# Altium project PCB_Project.PrjPcb
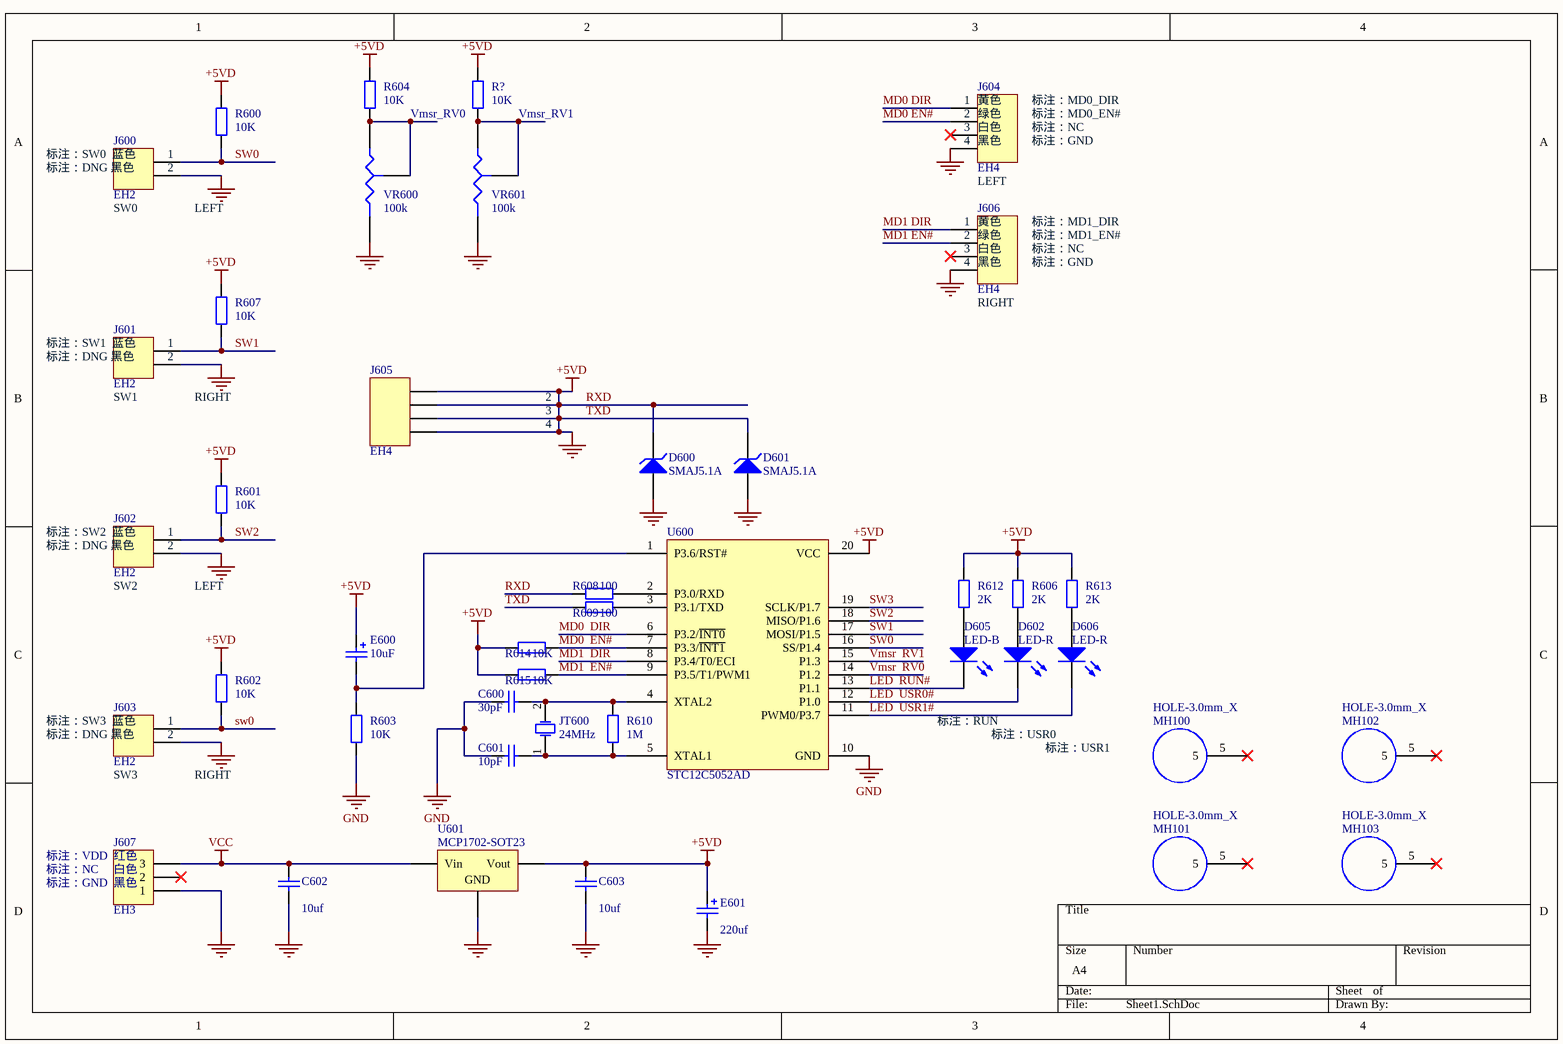
[diagram p0: Sheet1.SchDoc]
1 sheet, 43 parts. Net scope: global (net labels, ports and power ports of the same name join across sheets).
Board file: PCB.PcbDoc

## Sheet Sheet1.SchDoc
size A4

### Parts
C600  value 30pF  [RAD-0.3]  (hidden comment: Cap)
C601  value 10pF  [RAD-0.3]  (hidden comment: Cap)
C602  value 10uf  [RAD-0.3]
C603  value 10uf  [RAD-0.3]
D600  SMAJ5.1A  [DIODE-0.7]
D601  SMAJ5.1A  [DIODE-0.7]
D602  LED-R  [3.2X1.6X1.1]
D605  LED-B  [3.2X1.6X1.1]
D606  LED-R  [3.2X1.6X1.1]
E600  value 10uF  [POLAR0.8]  (hidden comment: Cap Pol2)
E601  value 220uf  [POLAR0.8]
J600  EH2  [HDR1X2H]
J601  EH2  [HDR1X2H]
J602  EH2  [HDR1X2H]
J603  EH2  [HDR1X2H]
J604  EH4  [HDR1X4H]
J605  EH4  [HDR1X4H]
J606  EH4  [HDR1X4H]
J607  EH3  [HDR1X3H]
JT600  24MHz  [R38]
MH100  HOLE-3.0mm_X  [MH]
MH101  HOLE-3.0mm_X  [MH]
MH102  HOLE-3.0mm_X  [MH]
MH103  HOLE-3.0mm_X  [MH]
R600  value 10K  [AXIAL-0.4]  (hidden comment: Res2)
R601  value 10K  [AXIAL-0.4]  (hidden comment: Res2)
R602  value 10K  [AXIAL-0.4]  (hidden comment: Res2)
R603  value 10K  [AXIAL-0.4]  (hidden comment: Res2)
R604  value 10K  [AXIAL-0.4]  (hidden comment: Res2)
R606  value 2K  [AXIAL-0.4]  (hidden comment: Res2)
R607  value 10K  [AXIAL-0.4]  (hidden comment: Res2)
R608  value 100  [AXIAL-0.4]  (hidden comment: Res2)
R609  value 100  [AXIAL-0.4]  (hidden comment: Res2)
R610  value 1M  [AXIAL-0.4]  (hidden comment: Res2)
R612  value 2K  [AXIAL-0.4]  (hidden comment: Res2)
R613  value 2K  [AXIAL-0.4]  (hidden comment: Res2)
R614  value 10K  [AXIAL-0.4]  (hidden comment: Res2)
R615  value 10K  [AXIAL-0.4]  (hidden comment: Res2)
R?  value 10K  [AXIAL-0.4]  (hidden comment: Res2)
U600  STC12C5052AD  [DIP20]
U601  (no value)  [D2PAK_N]
VR600  value 100k  [VR3]
VR601  value 100k  [VR3]

### Nets
+5VD: C600.1 C601.1 C603.2 D600.1(A) D600.2(K) D601.1(A) D601.2(K) E600.1 E601.1 J604.4 J605.1 J605.2 J605.3 J605.4 J606.4 R600.2 R601.2 R602.2 R603.1 R604.2 R606.2 R607.2 R612.2 R613.2 R614.2 R615.2 R?.2 U600.10(GND) U600.20(VCC) U601.3(Vout) VR600.2(B) VR601.2(B)  [also labelled GND]
LEFT: J600.1 J601.1 J602.1 J603.1
NetC602_1: C602.1 C603.1 E601.2 J607.1 U601.2(GND)
VCC: C602.2 J607.3 U601.1(Vin)
LED  RUN#: D605.2(K) U600.13(P1.1)
LED  USR0#: D602.2(K) U600.12(P1.0)
LED  USR1#: D606.2(K) U600.11(PWM0/P3.7)
MD0  DIR: U600.6(P3.2/~{INT0})
MD0  EN#: R614.1 U600.7(P3.3/~{INT1})
MD1  DIR: U600.8(P3.4/T0/ECI)
MD1  EN#: R615.1 U600.9(P3.5/T1/PWM1)
RXD: R608.2
SW0: U600.16(SS/P1.4)
SW1: U600.17(MOSI/P1.5)
SW2: U600.18(MISO/P1.6)
SW3: U600.19(SCLK/P1.7)
TXD: R609.2
Vmsr  RV0: U600.14(P1.2)
Vmsr  RV1: U600.15(P1.3)
NetC600_2: C600.2 JT600.2(OSC2) R610.2 U600.4(XTAL2)
NetC601_2: C601.2 JT600.1(OSC1) R610.1 U600.5(XTAL1)
NetD602_1: D602.1(A) R606.1
NetD605_1: D605.1(A) R612.1
NetD606_1: D606.1(A) R613.1
NetE600_2: E600.2 R603.2 U600.1(P3.6/RST#)
NetJ600_2: J600.2 R600.1
NetJ601_2: J601.2 R607.1
NetJ602_2: J602.2 R601.1
NetJ603_2: J603.2 R602.1
NetR604_1: R604.1 VR600.1(A) VR600.3(TAP)
NetR608_1: R608.1 U600.2(P3.0/RXD)
NetR609_1: R609.1 U600.3(P3.1/TXD)
NetR?_1: R?.1 VR601.1(A) VR601.3(TAP)

Not connected (* = marked no-connect by the designer): J604 1 2 3*; J606 1 2 3*; J607 2*; MH100 5*; MH101 5*; MH102 5*; MH103 5*

### Notes on the sheet
- (near R?) Vmsr_RV0
- Vmsr_RV1
- (near J604) MD0 DIR
- (near J604) MD0 EN#
- (near J604) 1
- (near J604) 2
- (near J604) 黄色
- (near J604) 绿色
- 标注：MD0_DIR
- 标注：MD0_EN#
- (near J600) 标注：SW0  蓝色
- (near J600) 标注：DNG 黑色
- (near J600) 1
- (near J600) 2
- (near R600) SW0
- (near J604) 3
- (near J604) 4
- LEFT
- (near J604) 白色
- (near J604) 黑色
- 标注：NC
- 标注：GND
- (near J600) SW0
- (near J606) MD1 DIR
- (near J606) MD1 EN#
- (near J606) 1
- (near J606) 2
- (near J606) 3
- (near J606) 黄色
- (near J606) 绿色
- (near J606) 白色
- 标注：MD1_DIR
- 标注：MD1_EN#
- (near J606) 4
- (near J606) RIGHT
- (near J606) 黑色
- (near J601) 标注：SW1  蓝色
- (near J601) 标注：DNG 黑色
- (near J601) 1
- (near J601) 2
- (near R607) SW1
- (near J601) SW1
- RIGHT
- 2
- 3
- 4
- RXD
- TXD
- (near J602) 标注：SW2  蓝色
- (near J602) 标注：DNG 黑色
- (near J602) SW2
- (near J602) 1
- (near J602) 2
- (near R601) SW2
- (near J603) 标注：SW3  蓝色
- (near J603) 1
- (near R602) sw0
- 标注：RUN
- (near J603) 标注：DNG 黑色
- (near J603) SW3
- (near J603) 2
- 标注：USR0
- 标注：USR1
- 标注：VDD
- (near J607) 红色
- (near U601) MCP1702-SOT23
- (near U601) Vin
- (near U601) Vout
- (near J607) 白色
- (near J607) 黑色
- (near U601) GND

### Library data of the parts
C600-C603 = Cap: Capacitor; Published: 8-Jun-2000; LatestRevisionDate: 17-Jul-2002; LatestRevisionNote: Re-released for DXP Platform.; PackageReference: RAD-0.3; Publisher: Altium Limited; PackageDescription: Radial Cap, Thru-Hole; 2 Leads; 0.3 in Pin Spacing
D600 D601 = D Zener: Zener Diode; Published: 8-Jun-2000; LatestRevisionDate: 17-Jul-2002; LatestRevisionNote: Re-released for DXP Platform.; PackageReference: DIODE-0.7; Publisher: Altium Limited; PackageDescription: Diode, Thru-Hole; 2 Leads; 0.7 in Pin Spacing
D602 D605 D606 = LED2: Typical RED, GREEN, YELLOW, AMBER GaAs LED; Published: 8-Jun-2000; LatestRevisionDate: 17-Jul-2002; LatestRevisionNote: Re-released for DXP Platform.; PackageVersion: Feb-2002; PackageReference: 3.2X1.6X1.1; Publisher: Altium Limited; PackageDescription: SM LED; 2 Flat Leads
E600 E601 = Cap Pol2: Polarized Capacitor (Axial); Published: 8-Jun-2000; LatestRevisionDate: 17-Jul-2002; LatestRevisionNote: Re-released for DXP Platform.; PackageReference: POLAR0.8; Publisher: Altium Limited; PackageDescription: Polarized Capacitor; 2 Leads
J600-J603 = Header 2H: Header, 2-Pin, Right Angle; LatestRevisionDate: 17-Jul-2002; LatestRevisionNote: Re-released for DXP Platform.; Publisher: Altium Limited
J604-J606 = Header 4H: Header, 4-Pin, Right Angle; LatestRevisionDate: 17-Jul-2002; LatestRevisionNote: Re-released for DXP Platform.; Publisher: Altium Limited
J607 = Header 3H: Header, 3-Pin, Right Angle; LatestRevisionDate: 17-Jul-2002; LatestRevisionNote: Re-released for DXP Platform.; Publisher: Altium Limited
JT600 = XTAL: Crystal Oscillator; Published: 8-Jun-2000; LatestRevisionDate: 17-Jul-2002; LatestRevisionNote: Re-released for DXP Platform.; PackageReference: R38; Publisher: Altium Limited; PackageDescription: Crystal, Thru-Hole; 2 Leads; Body 3.1 x 8.2 mm (Dia.xH)
MH100-MH103 = Component_1
R600-R604 R606-R610 R612-R615 R? = Res2: Resistor; Published: 8-Jun-2000; LatestRevisionDate: 17-Jul-2002; LatestRevisionNote: Re-released for DXP Platform.; PackageReference: AXIAL-0.4; Publisher: Altium Limited; PackageDescription: Axial Device, Thru-Hole; 2 Leads; 0.4 in Pin Spacing
U601 = Volt Reg: Voltage Regulator; Published: 24-Mar-1999; LatestRevisionDate: 29-May-2009; LatestRevisionNote: IPC-7351 Footprint Added.; PackageReference: D2PAK; Publisher: Altium Limited; PackageDescription: 3-Pin Transistor Outline Package 2.54 mm Pitch, 15.1 mm Lead Span
VR600 VR601 = Res Tap: Tapped Resistor; Sim Note: Enter the Resistance value and the set point into parameter fields.; Set Position: 0.5; Published: 24-Mar-1999; LatestRevisionDate: 17-Jul-2002; LatestRevisionNote: Re-released for DXP Platform.; PackageReference: VR3; Publisher: Altium Limited; PackageDescription: Variable Resistor, Thru-Hole; 3 Leads